# Altium schematic sheet 1302_07.SchDoc
size A
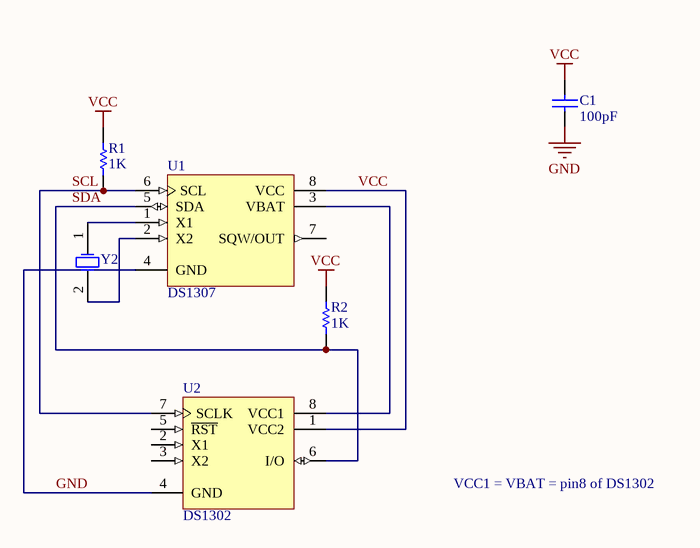
[diagram p0: 1302_07.SchDoc]

## Parts
C1  value 100pF  [C1206]  (hidden comment: .1uF 1206)
R1  value 1K  [R1206]  (hidden comment: 1K 1206)
R2  value 1K  [R1206]  (hidden comment: 1K 1206)
U1  DS1307  [DIP8]
U2  DS1302  [DIP8]
Y2  XTAL 32.768KHz 6pF  [R38]  (value not drawn)

## Nets
GND: C1.1 U1.4(GND) U2.4(GND)
VCC: C1.2 R1.2 R2.2 U1.8(VCC) U2.1(VCC2)
SCL: R1.1 U1.6(SCL) U2.7(SCLK)
SDA: R2.1 U1.5(SDA) U2.6(I/O)
NetU1_1: U1.1(X1) Y2.1(OSC1)
NetU1_2: U1.2(X2) Y2.2(OSC2)
NetU1_3: U1.3(VBAT) U2.8(VCC1)

Not connected (* = marked no-connect by the designer): U1 7(SQW/OUT); U2 2(X1) 3(X2) 5(~{RST})

## Notes on the sheet
- VCC1 = VBAT = pin8 of DS1302

## Library data of the parts
C1 = Cap: Capacitor; Published: 8-Jun-2000; LatestRevisionDate: 17-Jul-2002; LatestRevisionNote: Re-released for DXP Platform.; PackageReference: RAD-0.3; Publisher: Altium Limited; PackageDescription: Radial Cap, Thru-Hole; 2 Leads; 0.3 in Pin Spacing
R1 R2 = Res1: Resistor; Published: 8-Jun-2000; LatestRevisionDate: 17-Jul-2002; LatestRevisionNote: Re-released for DXP Platform.; PackageReference: AXIAL-0.3; Publisher: Altium Limited; PackageDescription: Axial Device, Thru-Hole; 2 Leads; 0.3 in Pin Spacing
U1 = DS1307: 64 X 8 Serial Real-Time Clock; Published: 13-Oct-2000; LatestRevisionDate: 17-Jul-2002; LatestRevisionNote: Re-released for DXP Platform.; DatasheetVersion: 10-Aug-1999; PackageVersion: 1999; PackageReference: DIP8; Publisher: Altium Limited; PackageDescription: DIP, 8-Pin, Row Spacing 7.62 mm, Pitch 2.54 mm; ComponentLink1Description: Manufacturer Link; ComponentLink1URL: http://www.maxim-ic.com/; ComponentLink2Description: Datasheet; ComponentLink2URL: http://pdfserv.maxim-ic.com/en/ds/DS1307.pdf; ComponentLink3Description: Discontinuation Notice; ComponentLink3URL: http://www.maxim-ic.com/qa/pdfs/non-obsolescence-letter.pdf
U2 = DS1302: Trickle Charge Timekeeping Chip; Published: 13-Oct-2000; LatestRevisionDate: 17-Jul-2002; LatestRevisionNote: Re-released for DXP Platform.; DatasheetVersion: 2-Jul-1999; PackageVersion: 1999; PackageReference: DIP8; Publisher: Altium Limited; PackageDescription: DIP, 8-Pin, Row Spacing 7.62 mm, Pitch 2.54 mm; ComponentLink1Description: Manufacturer Link; ComponentLink1URL: http://www.maxim-ic.com/; ComponentLink2Description: Datasheet; ComponentLink2URL: http://pdfserv.maxim-ic.com/en/ds/DS1302.pdf
Y2 = XTAL: Crystal Oscillator; Published: 8-Jun-2000; LatestRevisionDate: 17-Jul-2002; LatestRevisionNote: Re-released for DXP Platform.; PackageReference: R38; Publisher: Altium Limited; PackageDescription: Crystal, Thru-Hole; 2 Leads; Body 3.1 x 8.2 mm (Dia.xH)